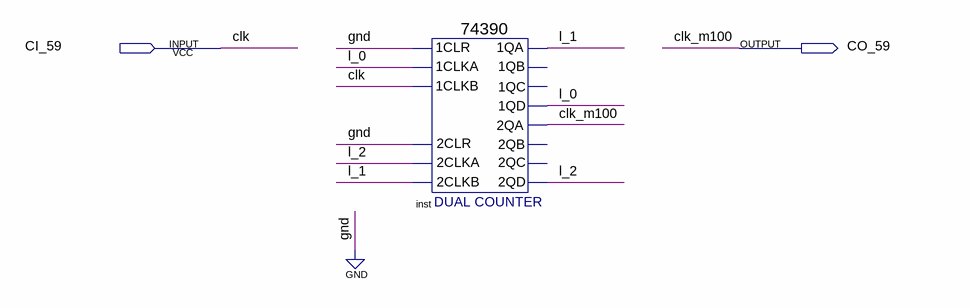
[diagram p0: schematic sheet]
// Quartus schematic m100_59.bdf as structural Verilog: 1 symbols, 2 pins
module m100_59 (
  input  CI_59,
  output CO_59
);

  wire l_0, l_1, l_2;

  \74390  inst (
    .\2CLKA (l_2), .\2CLR (1'b0), .\2CLKB (l_1), .\1CLR (1'b0), .\1CLKA (l_0), .\1CLKB (CI_59), .\1QA (l_1),
    .\1QD (l_0), .\2QA (CO_59), .\2QD (l_2));  // open: 1QB, 1QC, 2QB, 2QC

  // Other names for the same wires on the sheet: clk = CI_59; clk_m100 = CO_59
endmodule
